# EasyEDA Pro project ProPrj_智能车主控V5.0-20251108_2026-08-26.epro, board PCB11
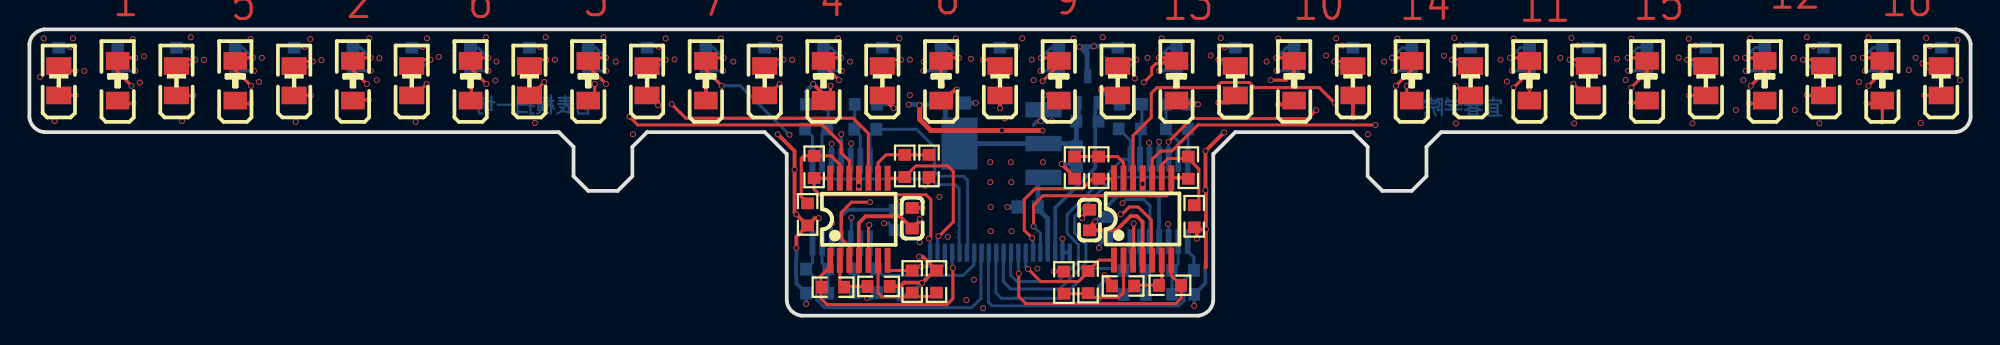
[diagram p9: board, top side]
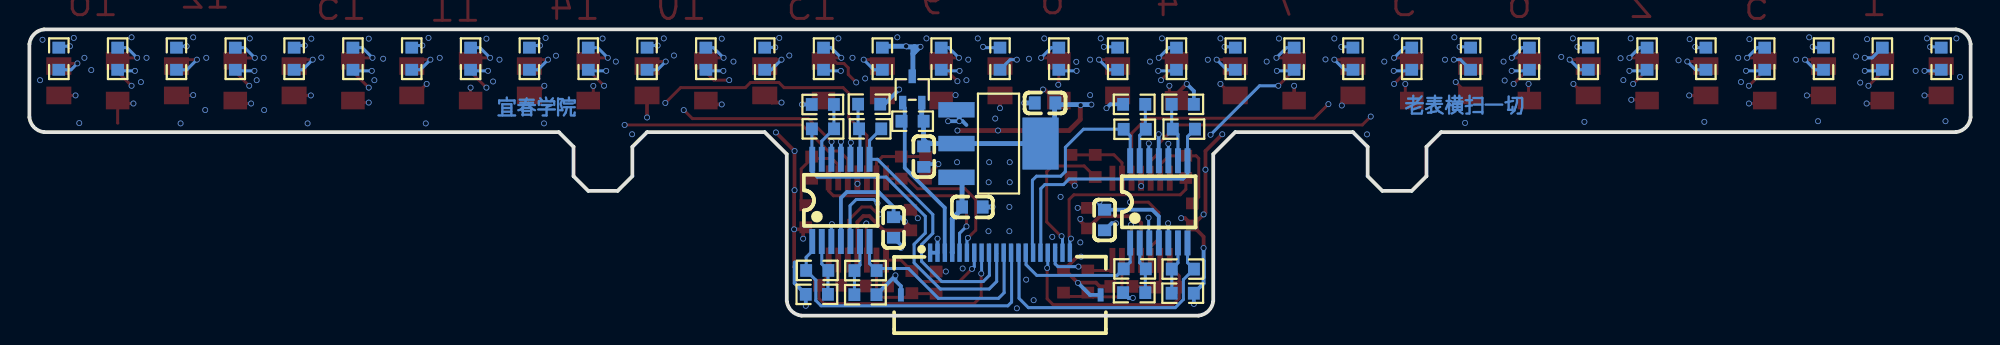
[diagram p10: board, bottom side, seen from below]

Outline 132 x 19.5 mm; copper layers: Top Layer, Inner1, Inner2, Bottom Layer. Coordinates in mm from the lower left corner of the outline.
Outline path: 0,18.5 0,13.5 arc(0.32,12.82) 1,12.5 36,12.5 37,11.5 37,9.5 38,8.5 40,8.5 41,9.5 41,11.5 42,12.5 50,12.5 51.5,11 51.5,1 arc(51.82,0.32) 52.5,0 79.5,0 arc(80.18,0.32) 80.5,1 80.5,11 82,12.5 90,12.5 91,11.5 91,9.5 92,8.5 94,8.5 95,9.5 95,11.5 96,12.5 131,12.5 arc(131.68,12.82) 132,13.5 132,18.5 arc(131.68,19.18) 131,19.5 1,19.5 arc(0.32,19.18) 0,18.5
Stack: Top Layer 0.035mm 外层铜厚1oz / Dielectric1 0.2104mm 7628 RC49% 8.6mil / Inner1 0.0152mm 内层铜厚 / Dielectric2 1.065mm 1.1mm H/HOZ Copper / Inner2 0.0152mm 内层铜厚 / Dielectric3 0.2104mm 7628 RC49% 8.6mil / Bottom Layer 0.035mm 外层铜厚1oz

## Design rules (mm)
spacing copperThickness1oz (default): track to track 0.102, other pairs 0.152 to 0.3
spacing copperThickness2oz: track to track 0.203, other pairs 0.152 to 0.3
spacing Plane_innerPlane: track to track 0.102, other pairs 0.152 to 0.3
spacing Copper_copperRegion: track to track 0.102, other pairs 0.152 to 0.3
track width copperThickness1oz (default): min 0.127, default 0.254, max 2.54
track width copperThickness2oz: min 0.203, default 0.254, max 2.54
differential pair differentialPair (default): width min 0.127, default 0.254, max 2.54; gap min 0.152, default 0.152
region e1 uses Copper_copperRegion
pour e1142 uses Copper_copperRegion
pour e1143 uses Copper_copperRegion
pour e1144 uses Copper_copperRegion
pour e1145 uses Copper_copperRegion

## Placement (name value [footprint] x y rotation side)
C1  10uF  [C0603]  67.88 7.4 0 bottom
C2  10uF  [C0603]  62.94 14.49 180 bottom
C2#2  -  [C0603]  71.18 10.83 90 bottom
C3  100nF  [C0603]  60.03 6.64 90 top
C4  100nF  [C0603]  72.09 6.51 90 top
C5  100nF  [C0603]  73.24 6 270 bottom
C6  100nF  [C0603]  58.89 6.51 270 bottom
FPC2  FPC-05F-20PH20  [FPC-SMD_20P-P0.50_XUNPU_FPC-05F-20PH20]  66 3 180 bottom
LED1  SCM-013RTT86  [LED-SMD_L3.0-W1.5-RD_SCM-013RTT86]  130 16 90 top
LED2  SCM-013RTT86  [LED-SMD_L3.0-W1.5-RD_SCM-013RTT86]  122 16 90 top
LED3  SCM-013RTT86  [LED-SMD_L3.0-W1.5-RD_SCM-013RTT86]  114 16 90 top
LED4  SCM-013RTT86  [LED-SMD_L3.0-W1.5-RD_SCM-013RTT86]  106 16 90 top
LED5  SCM-013RTT86  [LED-SMD_L3.0-W1.5-RD_SCM-013RTT86]  98 16 90 top
LED6  SCM-013RTT86  [LED-SMD_L3.0-W1.5-RD_SCM-013RTT86]  90 16 90 top
LED7  SCM-013RTT86  [LED-SMD_L3.0-W1.5-RD_SCM-013RTT86]  82 16 90 top
LED8  SCM-013RTT86  [LED-SMD_L3.0-W1.5-RD_SCM-013RTT86]  74 16 90 top
LED9  SCM-013RTT86  [LED-SMD_L3.0-W1.5-RD_SCM-013RTT86]  66 16 90 top
LED10  SCM-013RTT86  [LED-SMD_L3.0-W1.5-RD_SCM-013RTT86]  58 16 90 top
LED11  SCM-013RTT86  [LED-SMD_L3.0-W1.5-RD_SCM-013RTT86]  50 16 90 top
LED12  SCM-013RTT86  [LED-SMD_L3.0-W1.5-RD_SCM-013RTT86]  42 16 90 top
LED13  SCM-013RTT86  [LED-SMD_L3.0-W1.5-RD_SCM-013RTT86]  34 16 90 top
LED14  SCM-013RTT86  [LED-SMD_L3.0-W1.5-RD_SCM-013RTT86]  26 16 90 top
LED15  SCM-013RTT86  [LED-SMD_L3.0-W1.5-RD_SCM-013RTT86]  18 16 90 top
LED16  SCM-013RTT86  [LED-SMD_L3.0-W1.5-RD_SCM-013RTT86]  2 16 90 top
LED17  SCM-013RTT86  [LED-SMD_L3.0-W1.5-RD_SCM-013RTT86]  10 16 90 top
Q1  PMF170XP,115  [SOT-323-3_L2.0-W1.3-P1.30-LS2.1-BR]  71.97 15.4 270 bottom
Q2  SCM-014TBT86  [LED-SMD_L3.0-W1.5-RD]  14 16 90 top
Q3  SCM-014TBT86  [LED-SMD_L3.0-W1.5-RD]  22 16 90 top
Q4  SCM-014TBT86  [LED-SMD_L3.0-W1.5-RD]  30 16 90 top
Q5  SCM-014TBT86  [LED-SMD_L3.0-W1.5-RD]  38 16 90 top
Q6  SCM-014TBT86  [LED-SMD_L3.0-W1.5-RD]  46 16 90 top
Q7  SCM-014TBT86  [LED-SMD_L3.0-W1.5-RD#2]  54 16 90 top
Q8  SCM-014TBT86  [LED-SMD_L3.0-W1.5-RD]  62 16 90 top
Q9  SCM-014TBT86  [LED-SMD_L3.0-W1.5-RD]  70 16 90 top
Q10  SCM-014TBT86  [LED-SMD_L3.0-W1.5-RD]  78 16 90 top
Q11  SCM-014TBT86  [LED-SMD_L3.0-W1.5-RD]  86 16 90 top
Q12  SCM-014TBT86  [LED-SMD_L3.0-W1.5-RD]  94 16 90 top
Q13  SCM-014TBT86  [LED-SMD_L3.0-W1.5-RD]  102 16 90 top
Q14  SCM-014TBT86  [LED-SMD_L3.0-W1.5-RD]  110 16 90 top
Q15  SCM-014TBT86  [LED-SMD_L3.0-W1.5-RD]  118 16 90 top
Q16  SCM-014TBT86  [LED-SMD_L3.0-W1.5-RD]  126 16 90 top
Q17  SCM-014TBT86  [LED-SMD_L3.0-W1.5-RD]  6 16 90 top
R1  100R  [R0603]  130 17.5 90 bottom
R2  100R  [R0603]  122 17.5 90 bottom
R3  100R  [R0603]  114 17.5 90 bottom
R4  100R  [R0603]  106 17.5 90 bottom
R5  100R  [R0603]  98 17.5 90 bottom
R6  100R  [R0603]  90 17.5 90 bottom
R7  100R  [R0603]  82 17.5 90 bottom
R8  100R  [R0603]  74 17.5 90 bottom
R9  100R  [R0603]  66 17.5 90 bottom
R10  100R  [R0603]  58 17.5 90 bottom
R11  100R  [R0603]  50 17.5 90 bottom
R12  100R  [R0603]  42 17.5 90 bottom
R13  100R  [R0603]  34 17.5 90 bottom
R14  100R  [R0603]  26 17.5 90 bottom
R15  100R  [R0603]  18 17.5 90 bottom
R16  100R  [R0603]  2 17.5 90 bottom
R17  4.7MΩ  [R0603]  6 17.5 270 bottom
R18  100R  [R0603]  10 17.5 90 bottom
R20  10K  [R0603]  60.03 2.32 90 top
R21  1K  [R0603]  61.68 2.32 90 top
R22  4.7MΩ  [R0603]  14 17.5 270 bottom
R23  10K  [R0603]  59.52 10.2 270 top
R24  1K  [R0603]  61.17 10.2 270 top
R25  4.7MΩ  [R0603]  22 17.5 270 bottom
R26  10K  [R0603]  53.36 10.13 270 top
R27  1K  [R0603]  52.92 6.89 270 top
R28  4.7MΩ  [R0603]  30 17.5 270 bottom
R29  10K  [R0603]  54.65 1.94 180 top
R30  1K  [R0603]  57.74 1.99 0 top
R31  4.7MΩ  [R0603]  38 17.5 270 bottom
R32  10K  [R0603]  53.56 3.17 180 bottom
R33  1K  [R0603]  53.57 1.53 180 bottom
R34  4.7MΩ  [R0603]  46 17.5 270 bottom
R35  10K  [R0603]  53.5 12.7 180 bottom
R36  1K  [R0603]  53.57 14.39 180 bottom
R37  4.7MΩ  [R0603]  54 17.5 270 bottom
R38  10K  [R0603]  56.84 12.7 0 bottom
R39  1K  [R0603]  56.87 14.39 0 bottom
R40  4.7MΩ  [R0603]  62 17.5 270 bottom
R41  10K  [R0603]  56.84 3.18 0 bottom
R42  1K  [R0603]  56.87 1.57 0 bottom
R43  4.7MΩ  [R0603]  70 17.5 270 bottom
R44  10K  [R0603]  75.14 3.07 180 bottom
R45  1K  [R0603]  75.15 1.43 180 bottom
R46  4.7MΩ  [R0603]  78 17.5 270 bottom
R47  10K  [R0603]  74.83 12.72 180 bottom
R48  1K  [R0603]  74.9 14.4 180 bottom
R49  4.7MΩ  [R0603]  86 17.5 270 bottom
R50  10K  [R0603]  78.04 12.72 0 bottom
R51  1K  [R0603]  78.05 14.38 0 bottom
R52  4.7MΩ  [R0603]  94 17.5 270 bottom
R53  10K  [R0603]  78.43 3.08 0 bottom
R54  1K  [R0603]  78.45 1.45 0 bottom
R55  4.7MΩ  [R0603]  102 17.5 270 bottom
R56  10K  [R0603]  77.56 2.07 0 top
R57  1K  [R0603]  74.37 2.02 180 top
R58  4.7MΩ  [R0603]  110 17.5 270 bottom
R59  10K  [R0603]  78.81 10.08 270 top
R60  1K  [R0603]  79.21 6.77 270 top
R61  4.7MΩ  [R0603]  118 17.5 270 bottom
R62  10K  [R0603]  72.71 10.08 270 top
R63  1K  [R0603]  71.07 10.08 270 top
R64  4.7MΩ  [R0603]  126 17.5 270 bottom
R65  10K  [R0603]  71.99 2.28 90 top
R66  1K  [R0603]  70.34 2.25 90 top
R67  10K  [R0603]  71.94 13.24 180 bottom
U1  OPA4377AIPWR  [TSSOP-14_L5.0-W4.4-P0.65-LS6.4-BL]  56.41 6.56 0 top
U2  OPA4377AIPWR  [TSSOP-14_L5.0-W4.4-P0.65-LS6.4-BL]  55.2 7.75 180 bottom
U3  OPA4377AIPWR  [TSSOP-14_L5.0-W4.4-P0.65-LS6.4-BL]  76.82 7.85 180 bottom
U4  OPA4377AIPWR  [TSSOP-14_L5.0-W4.4-P0.65-LS6.4-BL]  75.7 6.58 0 top
U5  AMS1117-3.3  [SOT-223_L6.5-W3.5-P2.30-LS7.0-BR]  66.1 11.72 0 bottom

## Footprints (pads in the part's own frame, mm; a bottom-side part is the same pattern mirrored in y, then rotated)
C0603
  rect 0.8x0.9 smd: 1(-0.7,0) 2(0.7,0)
FPC-SMD_20P-P0.50_XUNPU_FPC-05F-20PH20
  rect 0.3x1.25 smd: 1(-4.75,1.288) 2(-4.25,1.288) 3(-3.75,1.288) 4(-3.25,1.288) 5(-2.75,1.288) 6(-2.25,1.288) 7(-1.75,1.288) 8(-1.25,1.288) 9(-0.75,1.288) 10(-0.25,1.288) 11(0.25,1.288) 12(0.75,1.288) 13(1.25,1.288) 14(1.75,1.288) 15(2.25,1.288) 16(2.75,1.288) 17(3.25,1.288) 18(3.75,1.288) 19(4.25,1.288) 20(4.75,1.288)
  rect 0.4x0.9 smd: 21(6.84,-1.587) 22(-6.739,-1.587)
LED-SMD_L3.0-W1.5-RD
  rect 1.2x1.6 smd: 1(-1.35,0) 2(1.35,0)
LED-SMD_L3.0-W1.5-RD#2
  rect 1.3x1.6 smd: 1(-1.35,0)
  rect 1.2x1.6 smd: 2(1.35,0)
LED-SMD_L3.0-W1.5-RD_SCM-013RTT86
  rect 1.2x1.7 smd: 1(-1,0) 2(1,0)
R0603
  rect 0.806x0.864 smd: 1(-0.753,0) 2(0.753,0)
SOT-223_L6.5-W3.5-P2.30-LS7.0-BR
  rect 2.465x1.05 smd: 1(2.857,-2.3) 2(2.857,0) 3(2.857,2.3)
  rect 2.465x3.54 smd: 4(-2.857,0)
SOT-323-3_L2.0-W1.3-P1.30-LS2.1-BR
  rect 0.936x0.5 smd: 1(0.898,-0.65) 2(0.898,0.65) 3(-0.898,0)
TSSOP-14_L5.0-W4.4-P0.65-LS6.4-BL
  rect 0.4x1.7 smd: 1(-1.95,-2.8) 2(-1.3,-2.8) 3(-0.65,-2.8) 4(0,-2.8) 5(0.65,-2.8) 6(1.3,-2.8) 7(1.95,-2.8) 8(1.95,2.8) 9(1.3,2.8) 10(0.65,2.8) 11(0,2.8) 12(-0.65,2.8) 13(-1.3,2.8) 14(-1.95,2.8)

## Nets
GND: C1.1 C2.1 C2#2.1 C3.2 C4.2 C5.2 C6.2 FPC2.1 FPC2.2 FPC2.21 FPC2.22 LED1.1 LED2.1 LED3.1 LED4.1 LED5.1 LED6.1 LED7.1 LED8.1 LED9.1 LED10.1 LED11.1 LED12.1 LED13.1 LED14.1 LED15.1 LED16.1 LED17.1 Q2.1 Q3.1 Q4.1 Q5.1 Q6.1 Q7.1 Q8.1 Q9.1 Q10.1 Q11.1 Q12.1 Q13.1 Q14.1 Q15.1 Q16.1 Q17.1 R21.2 R24.2 R27.2 R30.2 R33.2 R36.2 R39.2 R42.2 R45.2 R48.2 R51.2 R54.2 R57.2 R60.2 R63.2 R66.2 U1.11 U2.11 U3.11 U4.11 U5.1
VCC_3V3: C2.2 C2#2.2 C3.1 C4.1 C5.1 C6.1 Q1.2 R17.2 R22.2 R25.2 R28.2 R31.2 R34.2 R37.2 R40.2 R43.2 R46.2 R49.2 R52.2 R55.2 R58.2 R61.2 R64.2 R67.2 U1.4 U2.4 U3.4 U4.4 U5.2 U5.4
VCC_5V: C1.2 FPC2.4 U5.3
ADC1: FPC2.20 R26.2 U1.14
ADC2: FPC2.19 R23.2 U1.8
ADC3: FPC2.18 R20.2 U1.7
ADC4: FPC2.17 R29.2 U1.1
ADC5: FPC2.16 R35.2 U2.8
ADC6: FPC2.15 R38.2 U2.14
ADC7: FPC2.14 R41.2 U2.1
ADC8: FPC2.13 R32.2 U2.7
ADC9: FPC2.12 R53.2 U3.1
ADC10: FPC2.11 R44.2 U3.7
ADC11: FPC2.10 R50.2 U3.14
ADC12: FPC2.9 R47.2 U3.8
ADC13: FPC2.8 R56.2 U4.7
ADC14: FPC2.7 R65.2 U4.1
ADC15: FPC2.6 R62.2 U4.14
ADC16: FPC2.5 R59.2 U4.8
PH_PWM: FPC2.3 Q1.1 R67.1
VPP_3V3: Q1.3 R1.2 R2.2 R3.2 R4.2 R5.2 R6.2 R7.2 R8.2 R9.2 R10.2 R11.2 R12.2 R13.2 R14.2 R15.2 R16.2 R18.2
$1N50: Q5.2 R31.1 U1.5
$1N59: R20.1 R21.1 U1.6
$1N62: Q3.2 R25.1 U1.10
$1N65: R23.1 R24.1 U1.9
$1N68: Q17.2 R17.1 U1.12
$1N71: R26.1 R27.1 U1.13
$1N75: Q7.2 R37.1 U1.3
$1N78: R29.1 R30.1 U1.2
$1N83: R41.1 R42.1 U2.2
$1N86: R38.1 R39.1 U2.13
$1N89: R35.1 R36.1 U2.9
$1N92: R32.1 R33.1 U2.6
$1N98: Q8.2 R40.1 U2.5
$1N99: Q2.2 R22.1 U2.10
$1N100: Q6.2 R34.1 U2.3
$1N101: Q4.2 R28.1 U2.12
$1N108: R53.1 R54.1 U3.2
$1N111: R50.1 R51.1 U3.13
$1N114: R47.1 R48.1 U3.9
$1N117: R44.1 R45.1 U3.6
$1N123: Q11.2 R49.1 U3.5
$1N124: Q15.2 R61.1 U3.10
$1N125: Q9.2 R43.1 U3.3
$1N126: Q13.2 R55.1 U3.12
$1N133: R65.1 R66.1 U4.2
$1N136: R62.1 R63.1 U4.13
$1N139: R59.1 R60.1 U4.9
$1N142: R56.1 R57.1 U4.6
$1N148: Q10.2 R46.1 U4.5
$1N149: Q16.2 R64.1 U4.10
$1N150: Q12.2 R52.1 U4.3
$1N151: Q14.2 R58.1 U4.12
$1N7034: LED1.2 R1.1
$1N7069: LED2.2 R2.1
$1N7104: LED3.2 R3.1
$1N7139: LED4.2 R4.1
$1N7174: LED5.2 R5.1
$1N7209: LED6.2 R6.1
$1N7244: LED7.2 R7.1
$1N7279: LED8.2 R8.1
$1N7314: LED9.2 R9.1
$1N7349: LED10.2 R10.1
$1N7384: LED11.2 R11.1
$1N7419: LED12.2 R12.1
$1N7454: LED13.2 R13.1
$1N7489: LED14.2 R14.1
$1N7524: LED15.2 R15.1
$1N7559: LED16.2 R16.1
$1N7594: LED17.2 R18.1

## Via types
v1: diameter 0.4, hole 0.3, Top Layer to Bottom Layer, 293 vias

## Routing (per net, layer and track width the routed paths; a pad name or vN(x,y) marks a point on that pad's centre or on a via; arc(x,y) is an arc through that point)
GND: length 104.7
  Top Layer w0.203: v1(69.02,15.02) 69.43,15.02 70,14.45 ; LED4.1 105.77,15 v1(104.99,15.78) ; LED2.1 120.88,15 v1(120.86,15.02) ; 6,14.45 v1(7.07,14.45) ; v1(38.44,15.78) 38.44,14.89 38,14.45 ; v1(23.07,14.7) 22.25,14.7 22,14.45 ; LED3.1 v1(112.86,15) ; LED5.1 97.64,15 v1(96.99,15.66) ; 125.99,13.12 126,13.13 126,14.45 v1(124.93,14.45) ; 14,14.45 v1(15.07,14.45) ; LED14.1 26.23,15 v1(27.01,15.78) ; 30,14.45 30.06,14.51 v1(30.06,15.78) ; 54,14.45 54.48,14.93 v1(54.48,15.66) ; LED13.1 34.1,15 v1(35.01,15.91) ; 110,14.45 109.94,14.51 v1(108.93,14.51) ; 102,14.45 v1(102,15.53) ; 118,14.45 v1(116.93,14.45) ; LED11.1 50.23,15 v1(51.01,15.78) ; v1(93.66,15.65) 93.66,14.79 94,14.45 ; LED17.1 v1(11.14,15) ; LED15.1 v1(19.14,15) ; LED1.1 v1(128.86,15) ; LED16.1 v1(3.13,15)
  Top Layer w0.254: LED8.1 73.6,15.4 v1(72.86,15.4) ; v1(80.86,14.51) 81.51,14.51 LED7.1 ; R24.2 61.17,9.11 v1(60.92,8.85) ; R57.2 73.62,2.24 v1(73.11,2.74) ; 54,14.45 54,15.08 v1(53.3,15.78) ; v1(63.08,15.4) 62.95,15.4 62,14.45 ; 79.97,3.28 80,3.32 v1(80,5.88) ; R66.2 v1(69.68,3.01) ; R27.2 53.42,6.64 v1(53.68,6.64) ; R27.2 52.16,5.38 v1(52.16,4.61) ; R27.2 52.91,6.14 v1(52.16,6.89) 52.03,7.02 v1(52.03,9.94) 52.03,11.21 v1(50.89,12.36) ; v1(79.46,14.38) 79.39,14.45 78,14.45 ; v1(60.49,4.02) 60.74,4.02 R21.2 61.55,3.08 v1(60.7,2.23) 60.68,2.25 59.48,2.25 59.22,1.99 R30.2 ; C3.2 v1(60.72,7.34) ; 79.34,5.88 R60.2 ; 79.34,5.88 v1(80,5.88) ; 79.34,5.88 79.39,5.83 v1(79.39,5.24) ; C4.2 71.59,6.71 v1(71.59,6.64) ; R63.2 71.07,9.44 v1(70.19,10.32) ; v1(58.76,14.13) 58,14.89 LED10.1 ; v1(66,14.13) LED9.1 ; v1(80,5.88) 80,8.52 v1(79.97,8.55) 79.97,11.21 v1(79.97,11.21) v1(81.24,12.48) ; v1(84.92,14.39) 85.94,14.39 86,14.45 ; v1(42.76,14.31) 42.76,14.51 42.27,15 LED12.1 ; 46,14.45 v1(46,15.66) ; 90,15 v1(90,13.5)
  Bottom Layer w0.203: 67.2,7.32 67.2,7.38
  Bottom Layer w0.254: v1(58.76,14.13) 58.5,14.39 R39.2 ; R42.2 57.27,1.21 v1(56.97,1.21) ; v1(52.16,4.61) 52.16,3.75 52.13,3.72 52.13,2.62 52.16,2.6 52.16,2.19 R33.2 v1(52.82,0.8) ; v1(72.86,15.4) 73.86,14.4 R48.2 ; v1(69.53,13.24) v1(68.77,13.24) 68.54,13.24 68.28,12.99 ; v1(70.19,10.32) 70.99,10.32 C2#2.1 ; R45.2 73.11,2.72 ; 73.11,2.72 v1(73.11,2.74) ; 73.11,2.72 73.11,2.38 72.74,2.01 FPC2.22 ; U2.11 55.21,10.56 v1(55.21,12.36) ; v1(79.21,0.67) R54.2 79.97,2.21 79.97,3.63 ; R36.2 52.82,15.3 v1(53.3,15.78) ; U3.11 v1(76.82,11.85) ; v1(58.12,6.29) 58.41,6.29 C6.2 ; C5.2 72.73,4.8 v1(72.73,4.61) ; v1(60.7,2.23) 59.88,1.41 FPC2.21 ; FPC2.1 FPC2.2 v1(70.25,5.24) ; R51.2 v1(79.46,14.38)
  Bottom Layer w0.33: C2.1 v1(64.35,14.49) ; v1(68.77,13.24) 68.77,13.83 U5.1 ; v1(66.51,7.4) 66.51,7.4 C1.1
  vias: v1(0.72,16.26) v1(0.97,18.88) v1(1.71,13.25) v1(2.97,18.88) v1(3.74,16.67) v1(7.04,18.83) v1(7.51,15.87) v1(7.79,17.66) v1(10.37,13.24) v1(10.98,18.96) v1(11.86,17.43) v1(15.04,18.83) v1(15.62,15.91) v1(15.8,17.56) v1(18.11,13.2) v1(19.1,18.83) v1(19.86,17.39) v1(23.11,18.88) v1(23.61,16.04) v1(23.8,17.53) v1(26.26,13.2) v1(27.04,18.88) v1(27.84,17.63) v1(31.04,18.96) v1(31.68,16.02) v1(31.76,17.3) v1(34.38,13.13) v1(35.11,18.96) v1(35.74,17.44) v1(39.04,18.96) v1(39.87,17.3) v1(41.04,12.35) v1(43.27,18.88) v1(43.87,17.45) v1(47.03,18.88) v1(47.87,17.3) v1(51.01,18.88) v1(51.87,17.43) v1(54.99,18.88) v1(55.8,17.3) v1(56.4,8.83) v1(59.15,18.88) v1(59.87,17.44) v1(59.87,15.02) v1(60.54,4.99) v1(60.81,17.29) v1(61.88,8.09) v1(62.45,5.37) v1(62.99,18.88) v1(63.71,1.05) v1(64.03,17.5) v1(64.22,2.45) v1(64.86,0.5) v1(65.34,10.45) v1(65.34,9.09) v1(65.36,7.4) v1(65.36,5.75) v1(66.33,13.42) v1(66.74,10.45) v1(66.77,9.09) v1(66.78,5.75) v1(67.51,18.88) v1(68.16,17.44) v1(68.28,16.04) v1(68.54,3.21) v1(68.92,10.45) v1(71,18.88) v1(72.98,18.96) v1(75.17,16.16) v1(75.69,8.98) v1(76.03,17.56) v1(76.99,18.88) v1(80.33,17.72) v1(81.01,18.92) v1(84.12,17.3) v1(84.92,18.87) v1(88.17,17.72) v1(88.86,18.88) v1(91.02,12.36) v1(92.12,17.3) v1(93.03,18.88) v1(96.19,17.7) v1(96.9,18.92) v1(97.01,13.1) v1(100.03,17.44) v1(100.47,15.95) v1(100.92,18.87) v1(104.1,17.56) v1(104.86,18.92) v1(105.05,13.1) v1(107.95,17.5) v1(108.54,16.04) v1(108.93,18.87) v1(112.15,17.58) v1(112.83,18.87) v1(113.08,13.1) v1(116.04,14) v1(116.07,17.56) v1(116.55,16.04) v1(117.01,18.88) v1(119.97,17.56) v1(120.05,14.01) v1(120.86,18.96) v1(121.72,13.1) v1(124.04,17.56) v1(124.42,15.91) v1(125.05,18.96) v1(127.79,16.73) v1(128.26,17.56) v1(128.61,13.12) v1(128.98,18.92) v1(131.11,18.79) v1(131.28,16.04)
VCC_3V3: length 196.2
  Top Layer w0.254: v1(72.48,6.41) 71.88,5.81 73.91,5.81 74.88,6.78 75.3,6.78 75.7,6.38 U4.4 ; U1.4 56.4,3.77 56.4,6.31 56.86,6.77 59.2,6.77 C3.1 60.54,6.45 v1(60.54,6.59)
  Top Layer w0.33: v1(60.52,14.33) 60.54,14.31 60.54,13.37 61.3,12.61 v1(66.14,12.61) v1(68.9,12.61)
  Inner2 w0.203: v1(7.2,16.67) v1(15.27,16.67) v1(23.2,16.67) v1(31.21,16.67) v1(39.23,16.67) v1(47.17,16.67) v1(55.24,16.67)
  Inner2 w0.33: 60.54,16.67 v1(60.79,16.67) v1(68.75,16.67) v1(76.82,16.67) v1(84.81,16.67) v1(92.78,16.67) v1(100.82,16.67) v1(108.72,16.67) v1(116.7,16.67) v1(124.82,16.67) ; 60.54,16.67 60.52,16.65 v1(60.52,14.33) ; 60.54,16.67 v1(55.24,16.67)
  Bottom Layer w0.203: v1(68.75,16.67) 69.93,16.67 R43.2 ; v1(39.23,16.67) 38.07,16.67 R31.2 ; v1(47.17,16.67) 46.07,16.67 R34.2 ; v1(116.7,16.67) 117.93,16.67 R61.2 ; v1(76.82,16.67) 77.93,16.67 R46.2 ; R25.2 22.07,16.67 v1(23.2,16.67) ; v1(60.79,16.67) 61.93,16.67 R40.2 ; v1(100.82,16.67) 101.93,16.67 R55.2 ; R22.2 14.07,16.67 v1(15.27,16.67) ; R49.2 85.93,16.67 v1(84.81,16.67) ; R52.2 93.93,16.67 v1(92.78,16.67) ; R58.2 109.93,16.67 v1(108.72,16.67) ; v1(55.24,16.67) 54.07,16.67 R37.2 ; v1(124.82,16.67) 125.93,16.67 R64.2 ; R28.2 30.07,16.67 v1(31.21,16.67) ; R17.2 6.07,16.67 v1(7.2,16.67)
  Bottom Layer w0.254: U3.4 76.82,8.01 76.41,8.42 74.25,8.42 73.24,7.4 C5.1 72.77,6.7 v1(72.48,6.41) ; U2.4 55.2,4.96 55.2,6.77 55.65,7.21 C6.1 59.23,7.55 v1(59.23,7.78)
  Bottom Layer w0.33: 62.29,12.86 63.43,11.72 U5.2 70.93,11.72 71.2,11.99 71.2,12.84 ; 71.2,12.97 71.33,13.1 71.33,14.34 71.29,14.38 ; 62.29,12.78 62.29,14.44 C2.2 62.12,14.38 v1(59.79,14.38)
VCC_5V: length 5.4
  Bottom Layer w0.33: C1.2 68.58,9.04 U5.3 ; 68.58,7.27 69.24,6.61 69.24,4.3 FPC2.4
ADC1: length 13.8
  Top Layer w0.203: U1.14 53.38,9.36 R26.2 53.36,8.61 53.74,8.23 60.98,8.23 61.3,7.91 61.3,5.37 v1(61.17,5.24)
  Bottom Layer w0.203: FPC2.20 61.25,5.17 v1(61.17,5.24)
ADC2: length 11
  Top Layer w0.203: v1(61.81,5.41) 61.85,5.41 62.82,6.39 62.82,9.81 62.44,10.2 60.28,10.2 R23.2 59.44,9.36 U1.8
  Bottom Layer w0.203: v1(61.81,5.41) 61.75,5.35 FPC2.19
ADC3: length 5.5
  Top Layer w0.203: v1(60.66,3.34) 60.29,3.34 R20.2 58.51,3.08 58.36,3.23 U1.7
  Bottom Layer w0.203: v1(60.66,3.34) 62.06,3.34 62.25,3.53 FPC2.18 ; 62.26,4.64 62.22,4.64
ADC4: length 15.3
  Top Layer w0.203: v1(62.79,3.25) 62.79,1.15 62.4,0.75 54.23,0.75 53.81,1.18 53.81,2.7 54.46,3.35 U1.1
  Bottom Layer w0.203: v1(62.79,3.25) 62.75,3.29 FPC2.17
ADC5: length 17.5
  Bottom Layer w0.203: 63.23,4.8 63.23,8.65 62.95,8.93 61.68,8.93 61.3,9.31 53.55,9.31 53.25,9.61 U2.8 53.25,12.2 R35.2
ADC6: length 15.4
  Bottom Layer w0.203: U2.14 57.15,12.25 R38.2 60.32,12.7 61.55,11.47 61.55,9.81 61.87,9.5 63.52,9.5 63.8,9.22 63.8,4.87 63.73,4.8
ADC7: length 10.4
  Bottom Layer w0.203: U2.1 57.15,3.63 R41.2 58.04,2.74 63.5,2.74 64.23,3.47 64.23,4.8
ADC8: length 19.6
  Bottom Layer w0.203: U2.7 53.25,3.61 R32.2 53.53,2.45 53.53,1.1 54.08,0.54 64.07,0.54 64.7,1.18 64.7,4.77 64.73,4.8
ADC9: length 21.9
  Bottom Layer w0.203: 79.18,3.08 79.18,3.97 78.77,4.39 U3.1 ; 65.23,4.8 65.21,4.78 65.21,0.92 65.47,0.67 78.17,0.67 78.52,1.03 78.52,2.42 R53.2
ADC10: length 15.1
  Bottom Layer w0.203: 65.73,4.8 65.72,4.79 65.72,1.56 66.1,1.18 70.19,1.18 72.22,3.21 74.25,3.21 R44.2 74.87,3.55 U3.7
ADC11: length 24
  Bottom Layer w0.203: FPC2.10 66.23,4.26 66.23,2.32 66.74,1.81 70.06,1.81 71.84,3.6 71.84,4.86 71.08,5.62 71.08,6.77 73.75,9.43 78.42,9.43 78.8,9.81 78.8,10.62 78.79,10.63 ; 78.79,10.63 R50.2 ; 78.79,10.63 U3.14
ADC12: length 19.2
  Bottom Layer w0.203: 66.73,4.8 66.72,4.79 66.72,2.74 67.14,2.32 69.95,2.32 71.33,3.7 71.33,4.84 70.57,5.6 70.57,6.89 74.33,10.65 U3.8 74.87,11.93 R47.2
ADC13: length 17.3
  Top Layer w0.203: v1(67.28,2.87) 67.28,1.3 67.76,0.82 77.96,0.82 78.31,1.17 R56.2 77.65,2.73 U4.7
  Bottom Layer w0.203: v1(67.28,2.87) 67.25,2.89 67.25,4.28
ADC14: length 8
  Top Layer w0.203: 73.75,3.78 72.74,3.78 R65.2 71.99,2.98 71.33,2.32 68.77,2.32 v1(67.91,3.18)
  Bottom Layer w0.203: v1(67.91,3.18) 67.75,3.34 FPC2.7
ADC15: length 10.6
  Top Layer w0.203: 73.75,9.38 73.69,9.33 R62.2 72.3,9.33 71.62,8.64 68.38,8.64 67.65,7.91 67.65,5.82 v1(68.18,5.29)
  Bottom Layer w0.203: FPC2.6 68.25,5.22 v1(68.18,5.29)
ADC16: length 15.3
  Top Layer w0.203: R59.2 78.75,9.38 U4.8 77.65,8.49 77.32,8.16 68.92,8.16 68.28,7.52 v1(68.28,6.08)
  Bottom Layer w0.203: FPC2.5 68.75,5.61 v1(68.28,6.08)
PH_PWM: length 11.1
  Bottom Layer w0.254: 69.76,4.3 69.76,7.35 72.48,10.07 72.48,14.13 72.6,14.26
VPP_3V3: length 144.1
  Inner2 w0.33: v1(2.75,18.31) v1(10.74,18.31) v1(18.72,18.31) v1(26.73,18.31) v1(34.75,18.31) v1(42.79,18.31) v1(50.73,18.31) v1(58.94,18.31) v1(67.15,18.31) v1(71.41,18.31) ; v1(129.25,18.35) v1(121.31,18.35) v1(72.38,18.35)
  Bottom Layer w0.203: R12.2 42.06,18.31 v1(42.79,18.31) ; R16.2 2.06,18.31 v1(2.75,18.31) ; R14.2 26.68,18.25 v1(26.73,18.31) ; R7.2 81.98,18.27 v1(81.28,18.27) ; v1(34.75,18.31) 34.06,18.31 R13.2 ; v1(18.72,18.31) 18.66,18.25 R15.2 ; v1(105.28,18.4) 105.85,18.4 R4.2 ; v1(50.73,18.31) 50.06,18.31 R11.2 ; v1(67.15,18.31) 67.1,18.25 R9.2 ; R18.2 10.68,18.25 v1(10.74,18.31) ; R5.2 97.85,18.4 v1(97.28,18.4) ; R1.2 129.9,18.35 v1(129.25,18.35) ; R2.2 121.9,18.35 v1(121.31,18.35) ; 71.92,17.83 71.82,17.94 ; v1(58.94,18.31) 58.06,18.31 R10.2 ; v1(89.28,18.4) 89.85,18.4 R6.2 ; v1(113.28,18.4) 113.85,18.4 R3.2
  Bottom Layer w0.33: 71.82,18.31 71.92,18.2 71.92,16.28 ; 71.82,18.31 71.45,18.31 71.82,17.94 71.82,18.31 ; 71.82,18.31 72.34,18.31 v1(72.38,18.35) 73.9,18.35 R8.2
$1N50: length 34.3
  Top Layer w0.203: v1(39.2,17.56) 38.01,17.56 38,17.55 38,16.99 v1(39.2,15.78) ; v1(57.1,6.18) 57.06,6.14 U1.5
  Inner2 w0.203: v1(39.2,15.78) 44.54,15.78 45.17,15.15 55.08,15.15 57.49,12.74 57.49,9.05 56.35,7.91 56.35,7.27 57.1,6.52 v1(57.1,6.18)
  Bottom Layer w0.203: v1(39.2,17.56) 38.51,18.25 R31.1
$1N59: length 6.6
  Top Layer w0.203: 57.71,3.76 57.71,1.55 57.98,1.28 59.67,1.28 59.93,1.53 59.93,1.54 60.16,1.31 61.42,1.31 R21.1
$1N62: length 43.4
  Top Layer w0.203: v1(23.2,17.56) 22.01,17.56 22,17.55 22,16.73 v1(22.95,15.78) ; v1(43.67,14.41) 44.63,13.45 56.02,13.45 57.05,12.42 57.05,9.37 U1.10
  Inner2 w0.203: v1(22.95,15.78) 23.96,14.77 43.31,14.77 v1(43.67,14.41)
  Bottom Layer w0.203: R25.1 22.51,18.25 v1(23.2,17.56)
$1N65: length 4.7
  Top Layer w0.203: R24.1 R23.1 59.51,10.96 58.25,10.96 57.71,10.41 U1.9
$1N68: length 57.5
  Top Layer w0.203: v1(7.2,17.56) 6.01,17.56 6,17.55 6,16.6 v1(6.94,15.66) ; v1(40.79,13.56) 41.36,12.99 53.93,12.99 55.2,11.72 55.2,11.08 55.76,10.53 U1.12
  Inner2 w0.203: v1(6.94,15.66) 8.85,13.75 40.6,13.75 v1(40.79,13.56)
  Bottom Layer w0.203: R17.1 6.69,17.56 v1(7.2,17.56)
$1N71: length 7.1
  Top Layer w0.203: R27.1 52.48,8.08 52.48,10.71 52.66,10.89 R26.1 54.51,10.89 55.11,10.29 U1.13
$1N75: length 20.9
  Top Layer w0.203: U1.3 55.76,4.69 55.2,5.24 55.2,7.02 55.91,7.73 v1(57.15,7.73) ; v1(55.2,17.56) 54.01,17.56 54,17.55 54,17.09 v1(55.05,16.04)
  Inner2 w0.203: v1(57.15,7.73) 57.19,7.73 58.12,8.66 58.12,13.88 55.97,16.04 v1(55.05,16.04)
  Bottom Layer w0.203: R37.1 54.51,18.25 v1(55.2,17.56)
$1N78: length 3
  Top Layer w0.203: R29.1 55.45,1.99 56.74,1.99 ; 55.11,2.15 U1.2
$1N83: length 3.6
  Bottom Layer w0.203: U2.2 56.5,3.6 R41.1 56.12,3.15 R42.1
$1N86: length 4
  Bottom Layer w0.203: U2.13 56.5,12.28 R38.1 56.12,12.73 R39.1
$1N89: length 4
  Bottom Layer w0.203: U2.9 53.9,12.35 R35.1 54.32,12.78 R36.1
$1N92: length 3.6
  Bottom Layer w0.203: U2.6 53.9,3.59 R32.1 54.32,1.54 R33.1
$1N98: length 23.1
  Top Layer w0.203: v1(62.04,15.73) 62,15.77 62,17.55 62.01,17.56 v1(63.21,17.56)
  Inner2 w0.203: v1(54.57,6.29) 55.55,6.29 56.18,5.67 60.5,5.67 62.44,7.61 62.44,15.32 v1(62.04,15.73)
  Bottom Layer w0.203: v1(63.21,17.56) 62.51,18.25 R40.1 ; v1(54.57,6.29) 54.55,6.27 U2.5
$1N99: length 48
  Top Layer w0.203: v1(15.07,15.66) 14,16.73 14,17.55 14.01,17.56 v1(15.2,17.56)
  Inner2 w0.203: v1(15.07,15.66) 16.48,14.25 40.86,14.25 41.25,13.86 53.67,13.86 54.55,12.98 v1(54.55,11.71)
  Bottom Layer w0.203: R22.1 14.51,18.25 v1(15.2,17.56) ; U2.10 54.55,11.7 v1(54.55,11.71)
$1N100: length 21.2
  Top Layer w0.203: v1(47.08,15.66) 46,16.73 46,17.55 46.01,17.56 v1(47.2,17.56)
  Inner2 w0.203: v1(51.68,12.32) 52.66,11.34 52.66,8.67 53.55,7.78 55.33,7.78 55.9,7.22 v1(55.9,6.67)
  Bottom Layer w0.203: v1(47.08,15.66) 48.35,15.66 v1(51.68,12.32) ; v1(55.9,6.67) 55.89,6.66 55.89,4.99 U2.3 ; R34.1 46.51,18.25 v1(47.2,17.56)
$1N101: length 33.4
  Top Layer w0.203: v1(31.2,17.56) 30.01,17.56 30,17.55 30,16.86 v1(31.07,15.78)
  Inner2 w0.203: v1(31.07,15.78) 31.66,15.2 43.98,15.2 44.66,14.51 54.44,14.51 55.88,13.07 v1(55.88,11.73)
  Bottom Layer w0.203: v1(55.88,11.73) 55.88,11.29 55.85,11.26 U2.12 ; v1(31.2,17.56) 30.51,18.25 R28.1
$1N108: length 3.8
  Bottom Layer w0.203: R54.1 77.7,3.06 R53.1 78.12,3.52 U3.2
$1N111: length 4.1
  Bottom Layer w0.203: U3.13 78.12,11.89 77.29,12.72 77.29,12.73 R51.1
$1N114: length 3.8
  Bottom Layer w0.203: U3.9 75.52,12.66 75.65,12.79 R48.1
$1N117: length 3.8
  Bottom Layer w0.203: U3.6 75.52,3.45 R44.1 75.9,1.44 R45.1
$1N123: length 28.1
  Top Layer w0.203: v1(84.41,16.04) 85.46,16.04 86,16.58 86,17.55 85.99,17.56 v1(84.8,17.56)
  Inner2 w0.203: v1(84.41,16.04) 76.65,16.04 73.59,12.99 73.59,7.93 73.87,7.66 v1(74.33,7.66)
  Bottom Layer w0.203: R49.1 85.49,18.25 v1(84.8,17.56) ; U3.5 76.2,5.08 76.2,7.49 75.78,7.91 74.58,7.91 v1(74.33,7.66)
$1N124: length 49.4
  Top Layer w0.203: v1(117.05,15.66) 118,16.6 118,17.55 116.68,17.55 v1(116.67,17.56)
  Inner2 w0.203: v1(76.14,11.79) 76.14,12.58 77.06,13.5 89.11,13.5 89.68,14.06 115.46,14.06 v1(117.05,15.66)
  Bottom Layer w0.203: R61.1 117.36,18.25 v1(116.67,17.56) ; v1(76.14,11.79) 76.17,11.76 U3.10
$1N125: length 24.1
  Top Layer w0.203: v1(68.79,17.56) 69.99,17.56 70,17.55 70,17.07 v1(68.9,15.97)
  Inner2 w0.203: v1(77.43,6.23) 76.7,5.5 71.84,5.5 68.26,9.07 68.26,15.34 v1(68.9,15.97)
  Bottom Layer w0.203: R43.1 69.48,18.25 v1(68.79,17.56) ; v1(77.43,6.23) 77.47,6.19 U3.3
$1N126: length 31.6
  Top Layer w0.203: v1(87.51,14) 87.5,14 86.92,13.42 79.03,13.42 v1(77.45,11.84) ; v1(100.67,17.56) 101.99,17.56 102,17.55 102,16.61 v1(100.92,15.53)
  Inner2 w0.203: v1(87.51,14) 88.65,15.15 100.54,15.15 v1(100.92,15.53)
  Bottom Layer w0.203: R55.1 101.36,18.25 v1(100.67,17.56) ; U3.12 77.45,10.67 v1(77.45,11.84)
$1N133: length 6.5
  Top Layer w0.203: U4.2 74.4,1.57 74.07,1.25 72.41,1.25 72.15,1.5 70.34,1.5
$1N136: length 4.5
  Top Layer w0.203: R63.1 R62.1 74,10.83 74.4,10.43 U4.13
$1N139: length 6.1
  Top Layer w0.203: U4.9 77,10.27 77.43,10.7 78.81,10.7 79.52,9.99 79.52,7.73
$1N142: length 3.5
  Top Layer w0.203: U4.6 77,2.27 R56.1 75.17,2.07 R57.1
$1N148: length 22.3
  Top Layer w0.203: U4.5 76.29,3.85 76.29,6.51 75.4,7.4 74.79,7.4 74.29,6.9 v1(74.2,6.9) ; v1(76.79,17.56) 77.99,17.56 78,17.55 77.44,17.55 77.07,17.18 76.61,17.18 76.32,16.88 76.32,16.43 v1(75.78,15.89)
  Inner2 w0.203: v1(75.78,15.89) 72.98,13.09 72.98,7.53 73.61,6.9 v1(74.2,6.9)
  Bottom Layer w0.203: R46.1 77.49,18.25 v1(76.79,17.56)
$1N149: length 57.3
  Top Layer w0.203: v1(91.53,12.99) 79.46,12.99 77.68,11.21 76.92,11.21 76.35,10.64 U4.10 ; v1(125.05,15.66) 126,16.6 126,17.55 125.99,17.56 v1(124.67,17.56)
  Inner2 w0.203: v1(91.53,12.99) 92.09,13.55 122.95,13.55 v1(125.05,15.66)
  Bottom Layer w0.203: R64.1 125.36,18.25 v1(124.67,17.56)
$1N150: length 34.3
  Top Layer w0.203: v1(92.92,15.66) 94,16.73 94,17.55 93.99,17.56 v1(92.67,17.56) ; v1(75.09,6.28) 75.09,3.82 U4.3
  Inner2 w0.203: v1(92.92,15.66) 86.06,15.66 85.56,15.15 76.77,15.15 74.38,12.76 74.38,9.56 75.09,8.85 v1(75.09,6.28)
  Bottom Layer w0.203: R52.1 93.36,18.25 v1(92.67,17.56)
$1N151: length 45.6
  Top Layer w0.203: U4.12 75.05,12.26 76.29,13.5 76.29,15.15 76.67,15.53 80.69,15.53 81.03,15.88 82.97,15.88 83.31,15.53 87.72,15.53 v1(88.76,14.49) ; v1(108.93,15.53) 110,16.61 110,17.55 109.99,17.56 v1(108.67,17.56)
  Inner2 w0.203: v1(108.93,15.53) 108.04,14.64 88.91,14.64 v1(88.76,14.49)
  Bottom Layer w0.203: R58.1 109.36,18.25 v1(108.67,17.56)
$1N7034: length 2.8
  Top Layer w0.203: v1(128.74,17.18) 129.82,17.18 LED1.2
  Bottom Layer w0.203: v1(128.74,17.18) 129.17,16.75 R1.1
$1N7069: length 3.2
  Top Layer w0.203: LED2.2 121.57,17.44 v1(120.61,17.44)
  Bottom Layer w0.203: R2.1 121.3,16.75 v1(120.61,17.44)
$1N7104: length 3
  Top Layer w0.203: LED3.2 113.57,17.44 v1(112.74,17.44)
  Bottom Layer w0.203: R3.1 113.42,16.75 v1(112.74,17.44)
$1N7139: length 3
  Top Layer w0.203: v1(104.73,17.44) 105.57,17.44 LED4.2
  Bottom Layer w0.203: v1(104.73,17.44) 105.42,16.75 R4.1
$1N7174: length 3
  Top Layer w0.203: LED5.2 97.57,17.44 v1(96.73,17.44)
  Bottom Layer w0.203: v1(96.73,17.44) 97.42,16.75 R5.1
$1N7209: length 2.9
  Top Layer w0.203: LED6.2 89.69,17.31 v1(88.73,17.31)
  Bottom Layer w0.203: R6.1 89.29,16.75 v1(88.73,17.31)
$1N7244: length 2.7
  Top Layer w0.203: LED7.2 81.57,17.44 v1(80.86,17.44)
  Bottom Layer w0.203: v1(80.86,17.44) 81.55,16.75 R7.1
$1N7279: length 3
  Top Layer w0.203: LED8.2 74.44,17.44 v1(75.27,17.44)
  Bottom Layer w0.203: R8.1 74.58,16.75 v1(75.27,17.44)
$1N7314: length 2.8
  Top Layer w0.203: v1(64.86,17.44) 65.57,17.44 LED9.2
  Bottom Layer w0.203: R9.1 65.31,17.44 v1(64.86,17.44)
$1N7349: length 3
  Top Layer w0.203: v1(59.27,17.44) 58.44,17.44 LED10.2
  Bottom Layer w0.203: v1(59.27,17.44) 58.58,16.75 R10.1
$1N7384: length 3
  Top Layer w0.203: v1(51.27,17.44) 50.44,17.44 LED11.2
  Bottom Layer w0.203: R11.1 50.58,16.75 v1(51.27,17.44)
$1N7419: length 3
  Top Layer w0.203: v1(43.27,17.44) 42.44,17.44 LED12.2
  Bottom Layer w0.203: v1(43.27,17.44) 42.58,16.75 R12.1
$1N7454: length 2.7
  Top Layer w0.203: LED13.2 34.44,17.44 v1(35.14,17.44)
  Bottom Layer w0.203: R13.1 34.69,17.44 v1(35.14,17.44)
$1N7489: length 3
  Top Layer w0.203: LED14.2 26.44,17.44 v1(27.26,17.44)
  Bottom Layer w0.203: R14.1 26.58,16.75 v1(27.26,17.44)
$1N7524: length 2.9
  Top Layer w0.203: LED15.2 18.31,17.31 v1(19.26,17.31)
  Bottom Layer w0.203: v1(19.26,17.31) 18.7,16.75 R15.1
$1N7559: length 2.4
  Top Layer w0.203: LED16.2 2.33,16.67 v1(3.13,16.67)
  Bottom Layer w0.203: R16.1 2.07,16.67 v1(3.13,16.67)
$1N7594: length 3
  Top Layer w0.203: LED17.2 10.44,17.44 v1(11.26,17.44)
  Bottom Layer w0.203: R18.1 10.57,16.75 v1(11.26,17.44)

## Copper pours and planes (outline as drawn; the poured copper is in the pictures)
GND on Top Layer: -12.87,37.37 141.18,37.37 141.18,-32.1 -12.87,-32.1
GND on Bottom Layer: -18.33,47.53 137.5,47.53 137.5,-43.91 -18.33,-43.91
GND on Inner1: 10.19,64.34 107.04,64.34 107.04,-32.52 10.19,-32.52
VCC_3V3 on Inner2: -1.89,16.73 142.64,16.73 142.64,-19.59 -1.89,-19.59
VPP_3V3 on Inner2: -1.44,21.5 135.85,21.5 135.85,17.44 -1.44,17.44

## Text on the board
Bottom Layer: 老表横扫一切 | 宜春学院
Top Layer: 1 | 5 | 2 | 6 | 3 | 7 | 4 | 8 | 9 | 13 | 10 | 14 | 11 | 15 | 12 | 16
